# Altium project BY-IOM-v0.2.PrjPCB
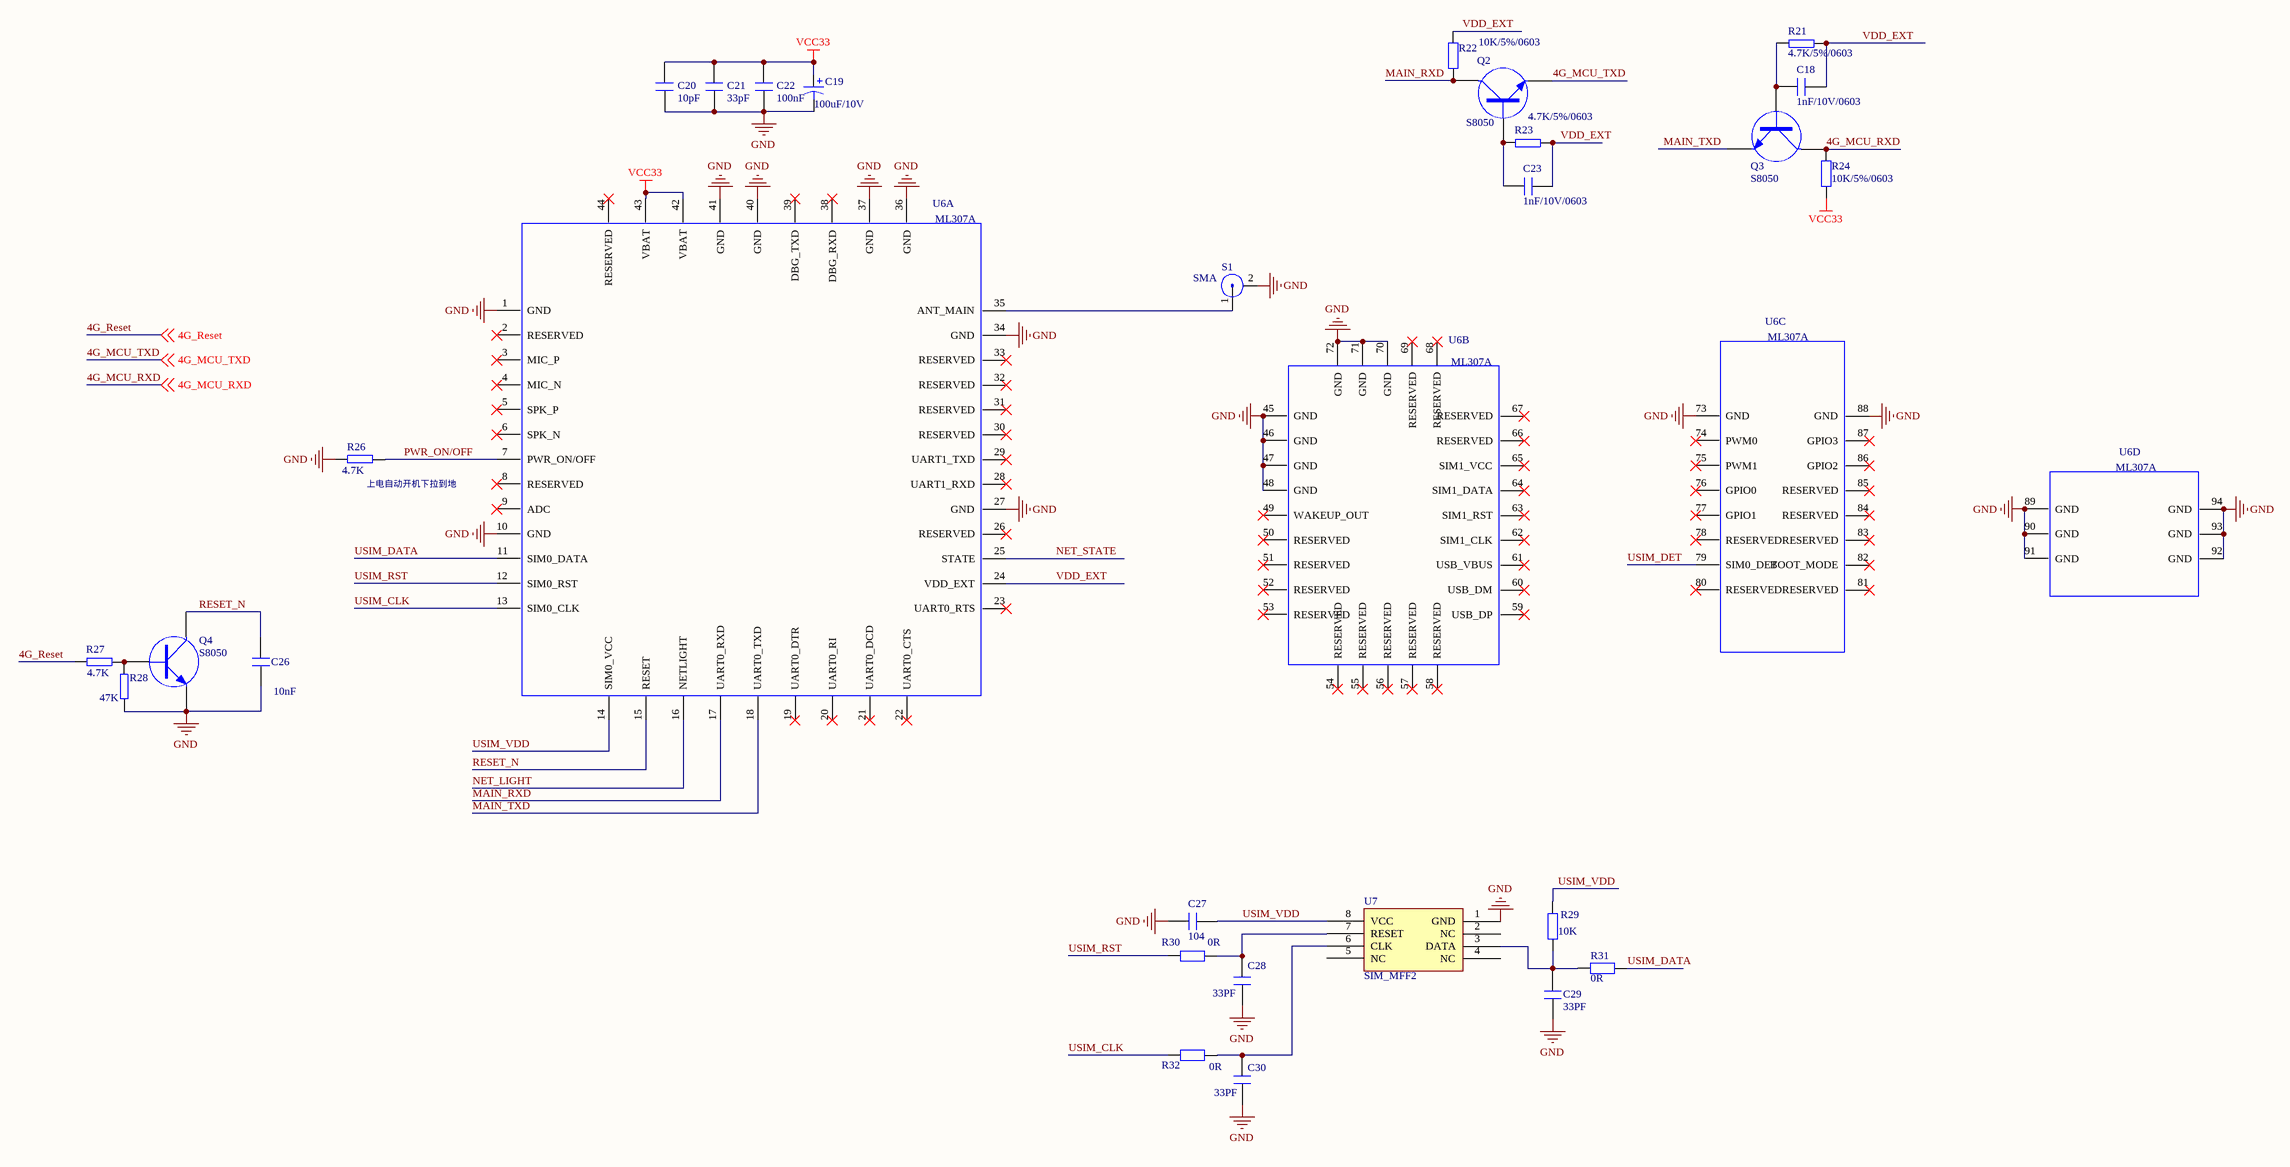
[diagram p0: 4G.SchDoc]
2 sheets, 58 parts. Net scope: global (net labels, ports and power ports of the same name join across sheets).
Board file: Power.PcbDoc
Sheets:
  4G.SchDoc
  漏电流检测.SchDoc

## Sheet 4G.SchDoc
size A2

### Parts
C18  1nF/10V/0603  [0603R]
C19  100uF/10V  [C1210]
C20  10pF  [0603R]
C21  33pF  [0603R]
C22  100nF  [0603R]
C23  1nF/10V/0603  [0603R]
C26  10nF  [0603R]
C27  104  [0603R]
C28  33PF  [0603R]
C29  33PF  [0603R]
C30  33PF  [0603R]
Q2  S8050  [SOT-23]
Q3  S8050  [SOT-23]
Q4  S8050  [SOT-23]
R21  4.7K/5%/0603  [0603R]
R22  10K/5%/0603  [0603R]
R23  4.7K/5%/0603  [0603R]
R24  10K/5%/0603  [0603R]
R26  4.7K  [0603R]
R27  4.7K  [0603R]
R28  47K  [0603R]
R29  10K  [0603R]
R30  0R  [0603R]
R31  0R  [0603R]
R32  0R  [0603R]
S1  SMA  [RF1-00283天线座]
U6  ML307A  [ML307A]  (parts A,B,C,D of 4)
U7  SIM_MFF2  [VQFN8]

### Nets
GND: C19.2 C20.2 C21.2 C22.2 C26.1 C27.1 C28.2 C29.1 C30.2 Q4.2(E) R26.2 R28.2 S1.2 U6.1(GND) U6.10(GND) U6.27(GND) U6.34(GND) U6.36(GND) U6.37(GND) U6.40(GND) U6.41(GND) U6.45(GND) U6.46(GND) U6.47(GND) U6.48(GND) U6.70(GND) U6.71(GND) U6.72(GND) U6.73(GND) U6.88(GND) U6.89(GND) U6.90(GND) U6.91(GND) U6.92(GND) U6.93(GND) U6.94(GND) U7.1(GND)
VCC33: C19.1 C20.1 C21.1 C22.1 R24.2 U6.42(VBAT) U6.43(VBAT)
4G_MCU_RXD: Q3.3(C) R24.1 ; off-sheet 4G_MCU_RXD
4G_MCU_TXD: Q2.2(E) ; off-sheet 4G_MCU_TXD
4G_Reset: R27.1 ; off-sheet 4G_Reset
MAIN_RXD: Q2.3(C) R22.2 U6.17(UART0_RXD)
MAIN_TXD: Q3.2(E) U6.18(UART0_TXD)
NET_LIGHT: U6.16(NETLIGHT)
NET_STATE: U6.25(STATE)
PWR_ON/OFF: R26.1 U6.7(PWR_ON/OFF)
RESET_N: C26.2 Q4.3(C) U6.15(RESET)
USIM_CLK: R32.2 U6.13(SIM0_CLK)
USIM_DATA: R31.1 U6.11(SIM0_DATA)
USIM_DET: U6.79(SIM0_DET)
USIM_RST: R30.2 U6.12(SIM0_RST)
USIM_VDD: C27.2 R29.1 U6.14(SIM0_VCC) U7.8(VCC)
VDD_EXT: C18.2 C23.2 R21.2 R22.1 R23.2 U6.24(VDD_EXT)
NetC18_1: C18.1 Q3.1(B) R21.1
NetC23_1: C23.1 Q2.1(B) R23.1
NetC28_1: C28.1 R30.1 U7.7(RESET)
NetC29_2: C29.2 R29.2 R31.2 U7.3(DATA)
NetC30_1: C30.1 R32.1 U7.6(CLK)
NetQ4_1: Q4.1(B) R27.2 R28.1
NetS1_1: S1.1 U6.35(ANT_MAIN)

Not connected (* = marked no-connect by the designer): U6 2(RESERVED)* 3(MIC_P)* 4(MIC_N)* 5(SPK_P)* 6(SPK_N)* 8(RESERVED)* 9(ADC)* 19(UART0_DTR)* 20(UART0_RI)* 21(UART0_DCD)* 22(UART0_CTS)* 23(UART0_RTS)* 26(RESERVED)* 28(UART1_RXD)* 29(UART1_TXD)* 30(RESERVED)* 31(RESERVED)* 32(RESERVED)* 33(RESERVED)* 38(DBG_RXD)* 39(DBG_TXD)* 44(RESERVED)* 49(WAKEUP_OUT)* 50(RESERVED)* 51(RESERVED)* 52(RESERVED)* 53(RESERVED)* 54(RESERVED)* 55(RESERVED)* 56(RESERVED)* 57(RESERVED)* 58(RESERVED)* 59(USB_DP)* 60(USB_DM)* 61(USB_VBUS)* 62(SIM1_CLK)* 63(SIM1_RST)* 64(SIM1_DATA)* 65(SIM1_VCC)* 66(RESERVED)* 67(RESERVED)* 68(RESERVED)* 69(RESERVED)* 74(PWM0)* 75(PWM1)* 76(GPIO0)* 77(GPIO1)* 78(RESERVED)* 80(RESERVED)* 81(RESERVED)* 82(BOOT_MODE)* 83(RESERVED)* 84(RESERVED)* 85(RESERVED)* 86(GPIO2)* 87(GPIO3)*; U7 2(NC) 4(NC) 5(NC)

### Notes on the sheet
- (near R26) 上电自动开机下拉到地

### Library data of the parts
C18 C23 C27-C30 = CAP
C19 = Cap Pol1: Polarized Capacitor (Radial); Published: 8-Jun-2000; LatestRevisionDate: 17-Jul-2002; LatestRevisionNote: Re-released for DXP Platform.; PackageReference: RB7.6-15; Publisher: Altium Limited; PackageDescription: Polarized Capacitor (Radial); 2 Leads
C20-C22 C26 = CAP_1
Q2-Q4 = NPN
R21 R23 R26-R28 = RES
R22 R24 R29-R32 = Res2: Resistor; Published: 8-Jun-2000; LatestRevisionDate: 17-Jul-2002; LatestRevisionNote: Re-released for DXP Platform.; PackageReference: AXIAL-0.4; Publisher: Altium Limited; PackageDescription: Axial Device, Thru-Hole; 2 Leads; 0.4 in Pin Spacing
U6 = ML307A: PCB DECAL: MOD_ML307

## Sheet 漏电流检测.SchDoc
size A4
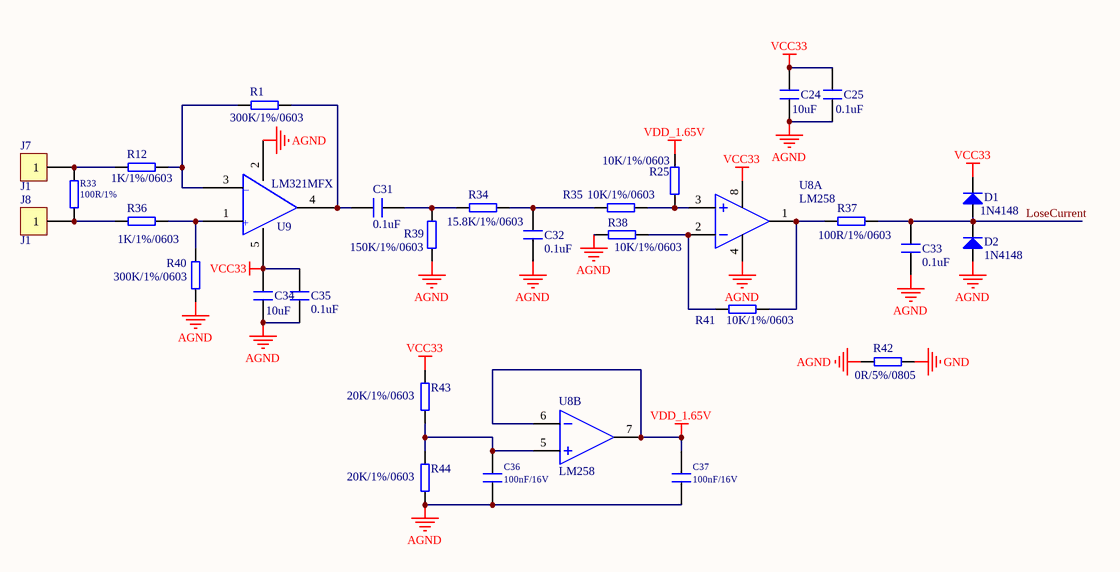
[diagram p1: 漏电流检测.SchDoc]

### Parts
C24  10uF  [0603R]
C25  0.1uF  [0603R]
C31  0.1uF  [0603R]
C32  0.1uF  [0603R]
C33  0.1uF  [0603R]
C34  10uF  [0603R]
C35  0.1uF  [0603R]
C36  100nF/16V  [0603R]
C37  100nF/16V  [0603R]
D1  1N4148  [1206D]
D2  1N4148  [1206D]
J7  J1  [贴片焊盘V1（3*2椭圆）]
J8  J1  [贴片焊盘V1（3*2椭圆）]
R1  300K/1%/0603  [0603r]
R12  1K/1%/0603  [0603r]
R25  10K/1%/0603  [0603r]
R33  100R/1%  [0805R]
R34  15.8K/1%/0603  [0603r]
R35  10K/1%/0603  [0603r]
R36  1K/1%/0603  [0603r]
R37  100R/1%/0603  [0603r]
R38  10K/1%/0603  [0603r]
R39  150K/1%/0603  [0603r]
R40  300K/1%/0603  [0603r]
R41  10K/1%/0603  [0603r]
R42  0R/5%/0805  [0805R]
R43  20K/1%/0603  [0603r]
R44  20K/1%/0603  [0603r]
U8  LM258  [SO8]  (parts A,B of 2)
U9  LM321MFX  [SOT-23-5]

### Nets
AGND: C24.1 C25.1 C32.2 C33.2 C34.1 C35.1 C36.2 C37.2 D2.2(A) R38.2 R39.1 R40.1 R42.2 R44.2 U8.4 U9.2
GND: R42.1
VCC33: C24.2 C25.2 C34.2 C35.2 D1.1(K) R43.1 U8.8 U9.5
VDD_1.65V: C37.1 R25.1 U8.6 U8.7
LoseCurrent: C33.1 D1.2(A) D2.1(K) R37.1
NetC31_1: C31.1 R34.2 R39.2
NetC31_2: C31.2 R1.1 U9.4
NetC32_1: C32.1 R34.1 R35.2
NetC36_1: C36.1 R43.2 R44.1 U8.5
NetJ7_1: J7.1 R12.1 R33.2
NetJ8_1: J8.1 R33.1 R36.2
NetR1_2: R1.2 R12.2 U9.3
NetR25_2: R25.2 R35.1 U8.3
NetR36_1: R36.1 R40.2 U9.1
NetR37_2: R37.2 R41.1 U8.1
NetR38_1: R38.1 R41.2 U8.2

### Notes on the sheet
- (in symbol LM321MFX) _; +

### Library data of the parts
C24 C25 C31-C37 = CAP
D1 D2 = DIODE
R1 R12 R25 R33-R44 = RES
U8 = LM358

## Nets that join several sheets
GND: 4G (37 pins), 漏电流检测 (R42.1)
VCC33: 4G (7 pins), 漏电流检测 (8 pins)